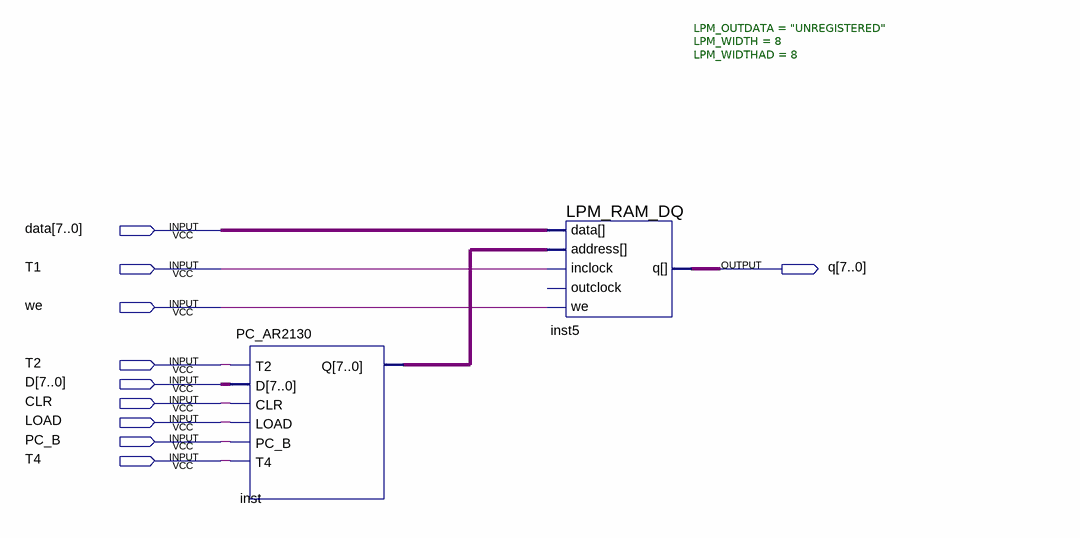
[diagram p0: schematic sheet]
// Quartus schematic PC_AR_RAM2130.bdf as structural Verilog: 2 symbols, 10 pins
module PC_AR_RAM2130 (
  input  [7:0] data,
  input  T1,
  input  we,
  input  T2,
  input  [7:0] D,
  input  CLR,
  input  LOAD,
  input  PC_B,
  input  T4,
  output [7:0] q
);

  wire [7:0] inst_q;

  PC_AR2130 inst (.T2(T2), .D(D), .CLR(CLR), .LOAD(LOAD), .PC_B(PC_B), .T4(T4), .Q(inst_q));
  LPM_RAM_DQ #(.LPM_OUTDATA("UNREGISTERED"), .LPM_WIDTH(8), .LPM_WIDTHAD(8)) inst5 (
    .inclock(T1), .data(data), .address(inst_q), .we(we), .q(q));  // open: outclock
endmodule
